# Altium schematic sheet Schemeatic_1_0.SchDoc
size A4; SheetNumber: 1; SheetTotal: 1
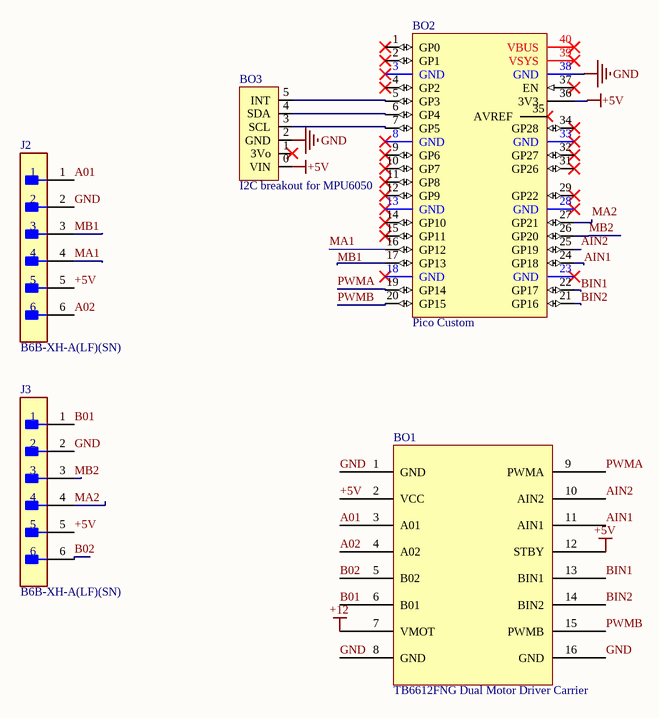
[diagram p0: Schemeatic_1_0.SchDoc]

## Parts
BO1  TB6612FNG Dual Motor Driver Carrier  [DIP16 - duplicate1]
BO2  Pico Custom  [DIP40]
BO3  I2C breakout for MPU6050  [PCBComponent_1]
J2  B6B-XH-A(LF)(SN)  [FP-B6B-XH-A_LF_SN-MFG]
J3  B6B-XH-A(LF)(SN)  [FP-B6B-XH-A_LF_SN-MFG]

## Nets
+5V: BO1.2(VCC) BO1.12(STBY) BO2.36(3V3) BO3.0(VIN) J2.5 J3.5
+12: BO1.7(VMOT)
GND: BO1.1(GND) BO1.8(GND) BO1.16(GND) BO2.38(GND) BO3.2(GND) J2.2 J3.2
A01: BO1.3(A01) J2.1
A02: BO1.4(A02) J2.6
AIN1: BO1.11(AIN1) BO2.24(GP18)
AIN2: BO1.10(AIN2) BO2.25(GP19)
B01: BO1.6(B01) J3.1
B02: BO1.5(B02) J3.6
BIN1: BO1.13(BIN1) BO2.22(GP17)
BIN2: BO1.14(BIN2) BO2.21(GP16)
MA1: BO2.16(GP12) J2.4
MA2: BO2.27(GP21) J3.4
MB1: BO2.17(GP13) J2.3
MB2: BO2.26(GP20) J3.3
PWMA: BO1.9(PWMA) BO2.19(GP14)
PWMB: BO1.15(PWMB) BO2.20(GP15)
NetBO2_5: BO2.5(GP3) BO3.5(INT)
NetBO2_6: BO2.6(GP4) BO3.4(SDA)
NetBO2_7: BO2.7(GP5) BO3.3(SCL)

Not connected (* = marked no-connect by the designer): BO2 1(GP0)* 2(GP1)* 3(GND)* 4(GP2)* 8(GND)* 9(GP6)* 10(GP7)* 11(GP8)* 12(GP9)* 13(GND)* 14(GP10)* 15(GP11)* 18(GND)* 23(GND)* 28(GND)* 29(GP22)* 31(GP26)* 32(GP27)* 33(GND)* 34(GP28)* 35(AVREF)* 37(EN)* 39(VSYS)* 40(VBUS)*; BO3 1(3Vo)*

## Library data of the parts
BO1 = TB6612FNG_Breakout
BO2 = PIco_custom_BO
BO3 = MPU_6050_IMU_I2C
J2 J3 = CMP-17439-000076-1: CONN HEADER VERT 6POS 2.5MM